# EAGLE design Botones (EAGLE 7.6.0)
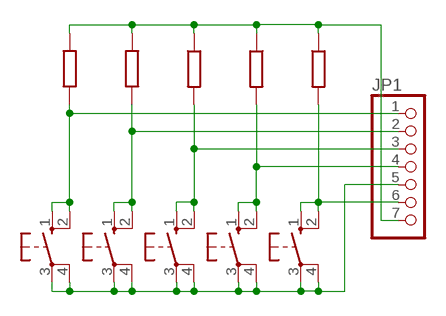
[diagram p0: schematic, sheet 1]

## Parts
ABAJO  10-XX  [B3F-10XX]
ARRIBA  10-XX  [B3F-10XX]
DERECHA  10-XX  [B3F-10XX]
IZQUIERDA  10-XX  [B3F-10XX]
JP1  PINHD-1X7  [1X07]
MENU  10-XX  [B3F-10XX]
R14  10K  R-EU_0204/7  [0204/7]
R15  10K  R-EU_0204/7  [0204/7]
R34  10K  R-EU_0204/7  [0204/7]
R35  10K  R-EU_0204/7  [0204/7]
R36  10K  R-EU_0204/7  [0204/7]

## Nets
N$20: DERECHA.1(S) DERECHA.2(S1) JP1.6 R36.2
N$34: ARRIBA.1(S) ARRIBA.2(S1) JP1.1 R15.1
N$45: ABAJO.1(S) ABAJO.2(S1) JP1.2 R14.1
N$47: JP1.3 MENU.1(S) MENU.2(S1) R34.2
N$48: IZQUIERDA.1(S) IZQUIERDA.2(S1) JP1.4 R35.2
N$52: ABAJO.3(P) ABAJO.4(P1) ARRIBA.3(P) ARRIBA.4(P1) DERECHA.3(P) DERECHA.4(P1) IZQUIERDA.3(P) IZQUIERDA.4(P1) JP1.5 MENU.3(P) MENU.4(P1)
N$53: JP1.7 R14.2 R15.2 R34.1 R35.1 R36.1

## Library data of the parts
ABAJO ARRIBA DERECHA IZQUIERDA MENU = switch-omron:10-XX: OMRON SWITCH; MPN: B3F-1000; OC_FARNELL: 176432; OC_NEWARK: 36M3542
JP1 = pinhead:PINHD-1X7: PIN HEADER
R14 R15 R34-R36 = rcl:R-EU_: RESISTOR, European symbol

## Board
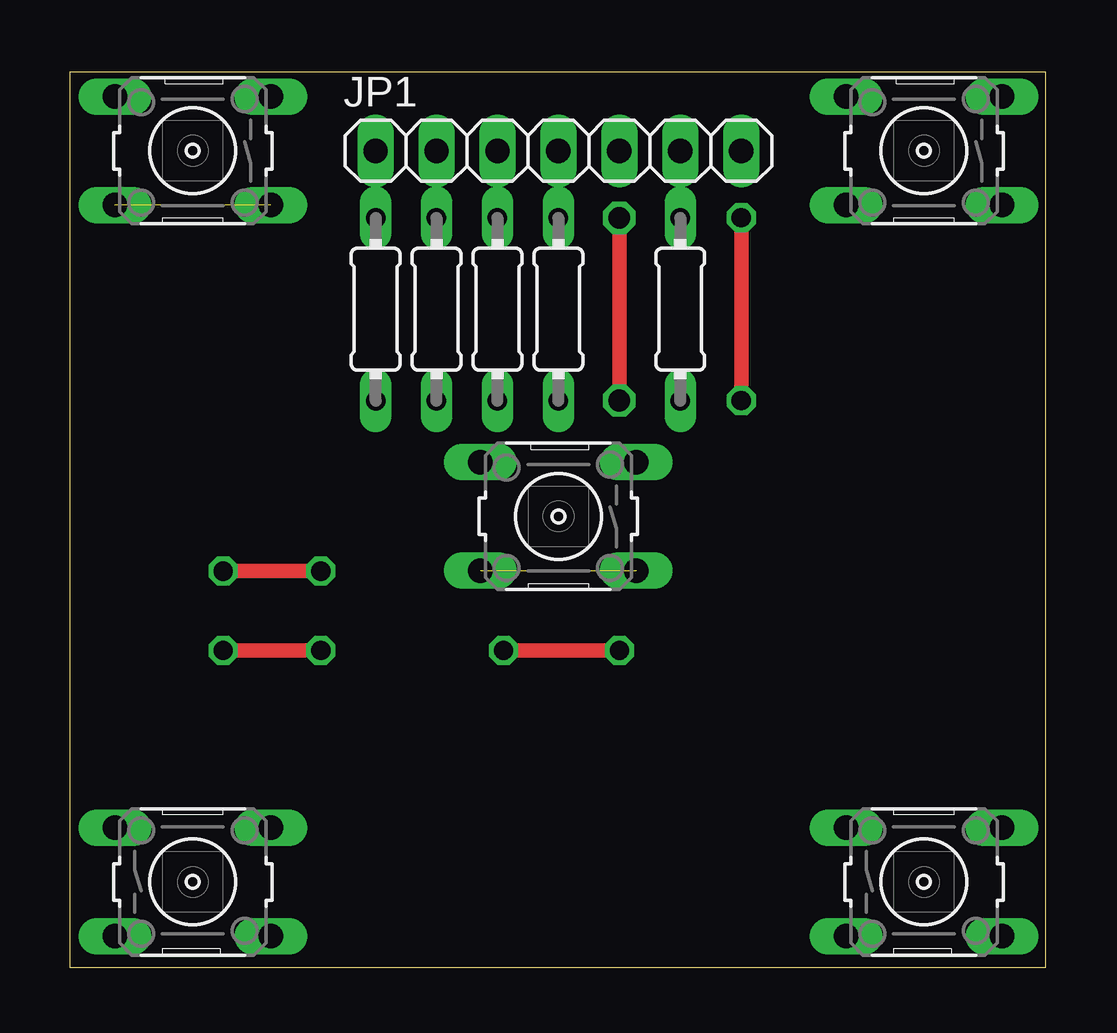
[diagram p1: board, top side]
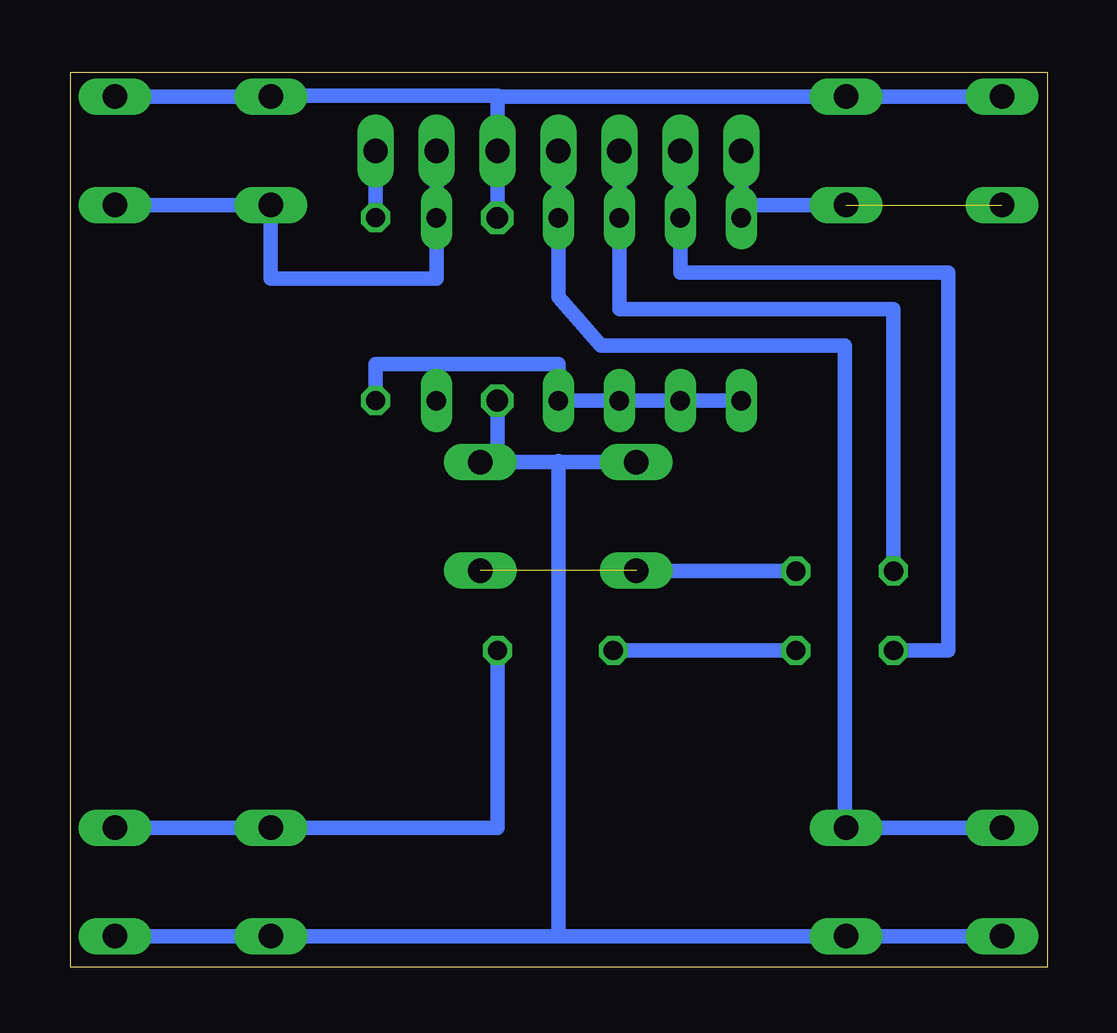
[diagram p2: board, bottom side, seen from below]

Size 40.69 x 37.32 mm. Coordinates in mm from the lower left corner, seen from the top.
Outline: 40.69,0 40.69,37.32 0,37.32 0,0 40.69,0
Copper layers (1*16): Top 0.035mm / dielectric 1.5mm / Bottom 0.035mm
Design rules "default": minimum track width 10mil, minimum drill 24mil, track to track 8mil, track to pad 8mil, pad to pad 8mil, via to via 8mil, smd to smd 8mil, copper to edge 40mil, drill to drill 8mil, minimum pad ring 10mil, minimum via ring 8mil, stop-mask expansion 4mil, vias tented up to drill 0mil, thermal gap 10mil

### Footprints (pad centres in the part's own frame; a part is rotated, then mirrored left to right if it is on the bottom)
B3F-10XX = drill 1.016 long: 1 -3.251,2.261; 2 3.251,2.261; 3 -3.251,-2.261; 4 3.251,-2.261
1X07 = drill 1.016 long: 1 -7.62,0; 2 -5.08,0; 3 -2.54,0; 4 0,0; 5 2.54,0; 6 5.08,0; 7 7.62,0
0204/7 = drill 0.813 long: 1 -3.81,0; 2 3.81,0

### Placement (x,y rotation side)
ABAJO  35.61,3.56 0 top
ARRIBA  5.13,34.04 180 top
DERECHA  35.61,34.04 180 top
IZQUIERDA  5.13,3.56 0 top
JP1  20.37,34.04 0 top
MENU  20.37,18.8 180 top
R14  15.29,27.43 270 top
R15  12.75,27.43 270 top
R34  17.83,27.43 90 top
R35  20.37,27.43 90 top
R36  25.45,27.43 90 top

### Tracks (layer width: path | path; a pad name or v marks a point on that pad's centre or on a via)
N$20
  Bottom 0.61: JP1.6 R36.2 25.45,28.7 32.36,28.7 DERECHA.2 DERECHA.1
N$34  (1 unrouted)
  Bottom 0.61: R15.1 12.75,31.77 | 12.75,31.77 JP1.1 | ARRIBA.1 12.75,31.77
N$45  (via drill 0.8)
  Top 0.61: v22.91,13.21 v18.08,13.21 | v10.46,13.21 v6.4,13.21
  Bottom 0.61: JP1.2 R14.1 15.29,28.96 4.12,28.96 4.12,13.21 v6.4,13.21 | ABAJO.2 ABAJO.1 22.91,5.82 v22.91,13.21 | v18.08,13.21 v10.46,13.21
N$47  (via drill 0.8)  (1 unrouted)
  Top 0.61: v6.4,16.51 v10.46,16.51
  Bottom 0.61: JP1.3 R34.2 17.83,27.43 6.4,27.43 v6.4,16.51 | v10.46,16.51 17.12,16.51 MENU.2
N$48
  Bottom 0.61: IZQUIERDA.2 IZQUIERDA.1 8.43,5.82 8.43,25.91 18.59,25.91 20.37,27.94 R35.2 JP1.4
N$52  (via drill 0.9)
  Top 0.61: v22.91,31.24 v22.91,23.62
  Bottom 0.61: DERECHA.4 DERECHA.3 32.31,36.3 32.31,36.32 22.91,36.32 22.91,36.3 | 22.91,36.3 ARRIBA.3 ARRIBA.4 | 22.91,36.3 JP1.5 v22.91,31.24 | IZQUIERDA.3 IZQUIERDA.4 20.37,1.29 | 20.37,1.29 ABAJO.3 ABAJO.4 | 20.37,21.06 20.37,1.29 | v22.91,23.62 22.91,21.06 | MENU.4 20.37,21.06 | 20.37,21.06 20.37,21.11 | 20.37,21.06 22.91,21.06 | 23.16,21.06 MENU.3 23.62,21.08 23.16,21.08 23.16,21.06 | 22.91,21.06 23.16,21.06
N$53  (via drill 0.8)
  Top 0.61: v27.99,31.24 v27.99,23.62
  Bottom 0.61: R15.2 R14.2 R34.1 R35.1 20.37,25.15 25.45,25.15 | R36.1 25.45,25.15 | 25.45,25.15 27.99,25.15 v27.99,23.62 | JP1.7 v27.99,31.24